# Altium project sensores_0v1.PrjPCB
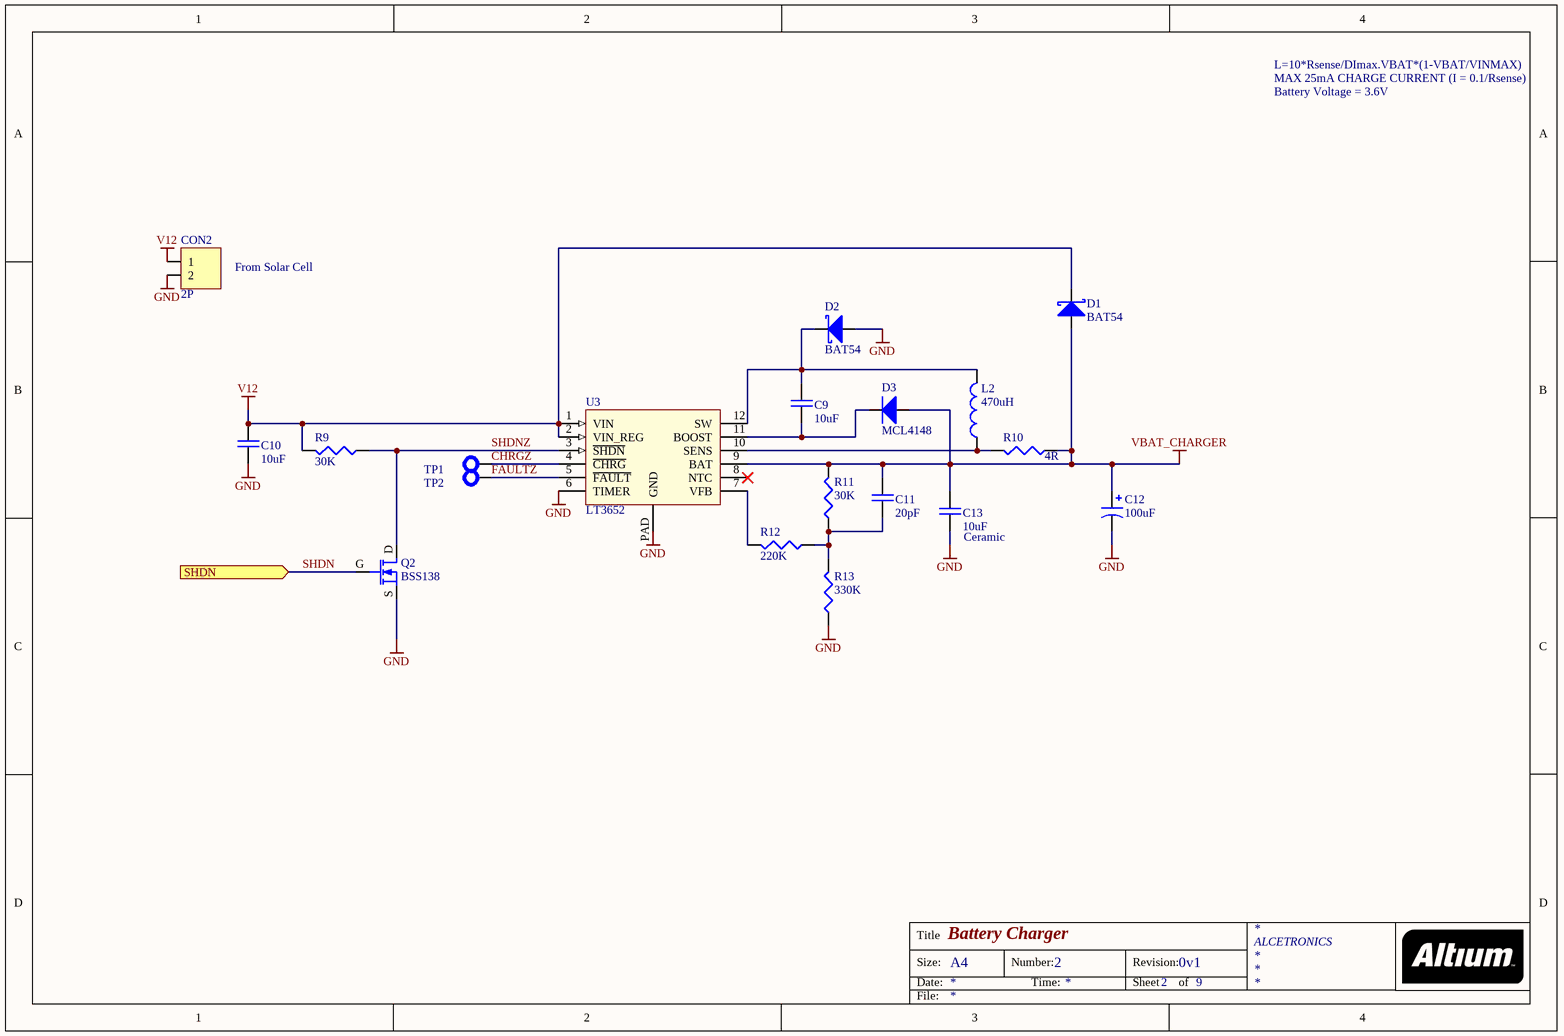
[diagram p0: Charger.SchDoc]
4 sheets, 91 parts. Net scope: flat (ports and power ports of the same name join across sheets).
Board file: sensores_0v1.PcbDoc
Sheets:
  Charger.SchDoc
  Boost.SchDoc
  Humidity.SchDoc
  Connectors.SchDoc

## Sheet Charger.SchDoc: Battery Charger
size A4; DrawnBy: Ricardo Rodrigues; Address1: ALCETRONICS; DocumentNumber: 2; Revision: 0v1; SheetNumber: 2; SheetTotal: 9

### Parts
C9  10uF  [0805]
C10  10uF  [0805]
C11  20pF  [0603]
C12  100uF  [RADIAL-5MM]
C13  10uF  [0805]
CON2  2P  [INTERLOCK2-5MM-FIXED]
D1  BAT54  [SOT-23@AK]
D2  BAT54  [SOT-23@AK]
D3  MCL4148  [0805@DIODE]
L2  470uH  [12X12]
Q2  BSS138  [SOT-23@GSD]
R9  30K  [0603]
R10  4R  [1206]
R11  30K  [0603]
R12  220K  [0603]
R13  330K  [0603]
TP1  Test Point  [TERMINAL]  (value not drawn)  (no BOM)
TP2  Test Point  [TERMINAL]  (value not drawn)  (no BOM)
U3  LT3652  [MSOP12@EP]

### Ports
SHDN (in)

### Nets
GND: C10.1 C12.2(N) C13.1 CON2.2 D2.A Q2.S R13.1 U3.6(TIMER) U3.PAD(GND)
V12: C10.2 CON2.1 D1.K R9.2 U3.1(VIN) U3.2(VIN_REG)
VBAT_CHARGER: C11.2 C12.1(P) C13.2 D1.A D3.A R10.1 R11.2 U3.9(BAT)
CHRGZ: TP1.1(TP) U3.4(~{CHRG})
FAULTZ: TP2.1(TP) U3.5(~{FAULT})
SHDN: Q2.G ; port SHDN
SHDNZ: Q2.D R9.1 U3.3(~{SHDN})
NetC9_1: C9.1 D3.K U3.11(BOOST)
NetC9_2: C9.2 D2.K L2.2 U3.12(SW)
NetC11_1: C11.1 R11.1 R12.1 R13.2
NetL2_1: L2.1 R10.2 U3.10(SENS)
NetR12_2: R12.2 U3.7(VFB)

Not connected (* = marked no-connect by the designer): U3 8(NTC)*

### Notes on the sheet
- MAX 25mA CHARGE CURRENT (I = 0.1/Rsense)
- Battery Voltage = 3.6V
- L=10*Rsense/DImax.VBAT*(1-VBAT/VINMAX)
- From Solar Cell
- (near C13) Ceramic
- Title
- Size:
- Date:
- A4
- Number:
- Time:
- Revision:
- Sheet
- of
- File:

### Library data of the parts
C9-C11 C13 = CAP: Capacitor; Owner: Nuno Brum; Sub-Type: Ceramic; Assembly: INS; Maximum Voltage: *; Creation Date: 2005-04-28; Status: Valid; Validation date: 2006-05-15; Type: Capacitor
C12 = CAP POL: Polarized Capacitor; Owner: Nuno Brum; Sub-Type: Tantalum; Assembly: INS; Validation date: 2006-05-15; Creation Date: 2005-04-28; Status: Valid; Type: Capacitor
CON2 = CON02: Connector 2 pins; Owner: Rui Rebelo; Assembly: INS; Sub-Type: Connector; Creation Date: 2005-05-27; Status: Valid; Validation Date: 2006-05-15; Type: Electrical & Mechanical
D1 D2 = Diode Schottky: Small Signal Schottky Diode; Owner: Nuno Brum; Assembly: INS; Validation date: 2006-05-15; Creation Date: 2001-06-05; Sub-Type: Schottky; Status: Valid; Model: BAT54; Type: Diode
D3 = Diode: Vishay Standard Avalanche Sinterglass Diode; Owner: Nuno Brum; Sub-Type: Generic; Assembly: INS; Validation date: 2006-05-15; Creation Date: 2001-06-05; Status: Valid; Model: MCL4148; Type: Diode
L2 = IND: Inductor; Owner: Nuno Brum; Sub-Type: Generic; Assembly: INS; Validation date: 2006-05-15; Creation Date: 2002-07-17; Status: Valid; Type: Inductor
Q2 = MOSFET-N: N-Channel Logic Level Enhancement Mode Field Effect Transistor; pin to pad: 2>3 3>2; Owner: Nuno Brum; Sub-Type: MOSFET; Assembly: INS; Creation Date: 2001-06-05; Status: Valid; Model: BSS138; Type: Transistor
R9-R13 = RES: Resistor; Owner: Nuno Brum; Sub-Type: Generic; Assembly: INS; Validation date: 2006-05-15; Creation Date: 2002-07-17; Status: Valid; Power: *; Type: Resistor
TP1 TP2 = TEST-PROBE: Test/Probe Point; Owner: Nuno Brum; Sub-Type: Mechanical; Assembly: PCB; Validation Date: 2006-05-15; Type: PCB; Creation Date: 2005-06-01; Status: Valid
U3 = LT3652: Power Tracking 2A Battery Charger for Solar Power; Type: IC; Creation Date: 2012-03-05

## Sheet Boost.SchDoc: Battery Charger Boost Converter
size A4; DocumentNumber: 3; Revision: 0v1; SheetNumber: 3; SheetTotal: 9
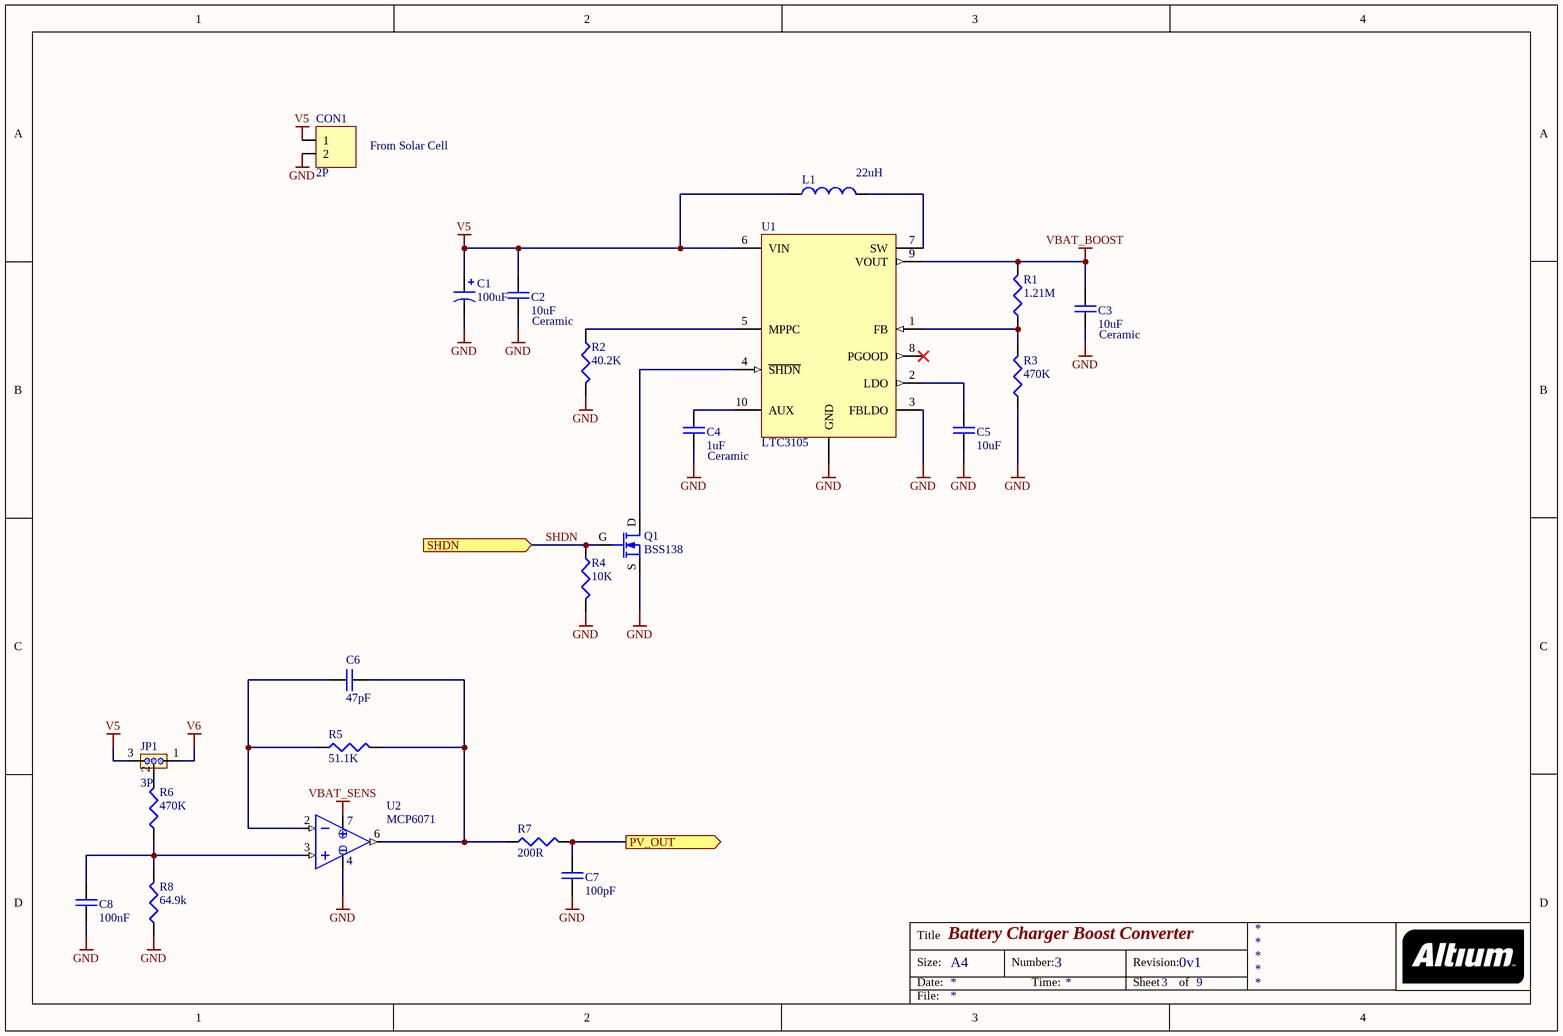
[diagram p1: Boost.SchDoc]

### Parts
C1  100uF  [RADIAL-5MM]
C2  10uF  [0805]
C3  10uF  [0805]
C4  1uF  [0603]
C5  10uF  [0805]
C6  47pF  [0603]
C7  100pF  [0603]
C8  100nF  [0603]
CON1  2P  [JST-2MM]
JP1  3P  [SIP-3]
L1  22uH  [7X7]
Q1  BSS138  [SOT-23@GSD]
R1  1.21M  [0603]
R2  40.2K  [0603]
R3  470K  [0603]
R4  10K  [0603]
R5  51.1K  [0603]
R6  470K  [0603]
R7  200R  [0603]
R8  64.9k  [0603]
U1  LTC3105  [DFN-10]
U2  MCP6071  [SOIC-8]

### Ports
PV_OUT (out), SHDN (in)

### Nets
GND: C1.2(N) C2.1 C3.1 C4.1 C5.1 C7.1 C8.1 CON1.2 Q1.S R2.2 R3.1 R4.2 R8.1 U1.3(FBLDO) U1.PAD(GND) U2.4(VSS)
V5: C1.1(P) C2.2 CON1.1 JP1.3 L1.1 U1.6(VIN)
V6: JP1.1
VBAT_BOOST: C3.2 R1.2 U1.9(VOUT)
VBAT_SENS: U2.7(VDD)
SHDN: Q1.G R4.1 ; port SHDN
NetC4_2: C4.2 U1.10(AUX)
NetC5_2: C5.2 U1.2(LDO)
NetC6_1: C6.1 R5.1 U2.2(INN)
NetC6_2: C6.2 R5.2 R7.1 U2.6(VOUT)
NetC7_2: C7.2 R7.2 ; port PV_OUT
NetC8_2: C8.2 R6.1 R8.2 U2.3(INP)
NetJP1_2: JP1.2 R6.2
NetL1_2: L1.2 U1.7(SW)
NetQ1_D: Q1.D U1.4(~{SHDN})
NetR1_1: R1.1 R3.2 U1.1(FB)
NetR2_1: R2.1 U1.5(MPPC)

Not connected (* = marked no-connect by the designer): U1 8(PGOOD)*

### Notes on the sheet
- From Solar Cell
- Ceramic
- (near C3) Ceramic
- Title
- Size:
- Date:
- A4
- Number:
- Time:
- Revision:
- Sheet
- of
- File:

### Library data of the parts
C1 = CAP POL: as C12 on sheet Charger; Validation date: 2006-05-15; Creation Date: 2005-04-28; Status: Valid; Type: Capacitor
C2-C8 = CAP: as C9 on sheet Charger; Maximum Voltage: *; Creation Date: 2005-04-28; Status: Valid; Validation date: 2006-05-15; Type: Capacitor
CON1 = CON02: as CON2 on sheet Charger; Sub-Type: Connector; Creation Date: 2005-05-27; Status: Valid; Validation Date: 2006-05-15; Type: Electrical & Mechanical
JP1 = JMP3: 3-Jumper; Owner: Nuno Brum; Sub-Type: Connector; STATE1: 0; Assembly: INS; Validation Date: 2006-05-15; Creation Date: 2002-07-17; Status: Valid; Type: Electrical & Mechanical
L1 = IND: as L2 on sheet Charger; Validation date: 2006-05-15; Creation Date: 2002-07-17; Status: Valid; Type: Inductor
Q1 = MOSFET-N: N-Channel Logic Level Enhancement Mode Field Effect Transistor; pin to pad: 2>3 3>2; Owner: Nuno Brum; Sub-Type: MOSFET; Assembly: INS; Creation Date: 2001-06-05; Status: Valid; Model: BSS138; Type: Transistor
R1-R8 = RES: as R9 on sheet Charger; Validation date: 2006-05-15; Creation Date: 2002-07-17; Status: Valid; Power: *; Type: Resistor
U1 = LTC3105: 400mA Step-Up DCDC Converter With MPPC and 250mV Start-Up; Type: IC; Creation Date: 2012-03-14
U2 = MCP6V26: Low-Offset Opamp; Type: IC; Creation Date: 2012-03-15

## Sheet Humidity.SchDoc: Humidity Sensor
size A4; DocumentNumber: 6; Revision: 0v1; SheetNumber: 6; SheetTotal: 9
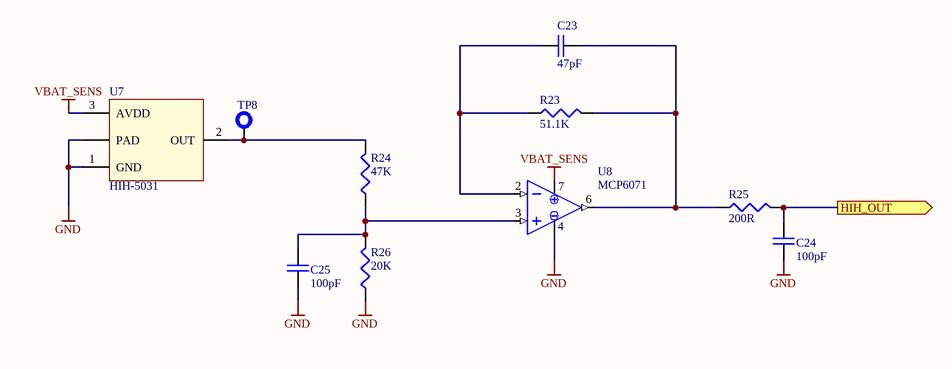
[diagram p2: Humidity.SchDoc]

### Parts
C23  47pF  [0603]
C24  100pF  [0603]
C25  100pF  [0603]
R23  51.1K  [0603]
R24  47K  [0603]
R25  200R  [0603]
R26  20K  [0603]
TP8  Test Point  [TERMINAL]  (value not drawn)  (no BOM)
U7  HIH-5031  [HIH]
U8  MCP6071  [SOIC-8]

### Ports
HIH_OUT (out)

### Nets
GND: C24.1 C25.1 R26.1 U7.1(GND) U7.PAD U8.4(VSS)
VBAT_SENS: U7.3(AVDD) U8.7(VDD)
NetC23_1: C23.1 R23.1 U8.2(INN)
NetC23_2: C23.2 R23.2 R25.1 U8.6(VOUT)
NetC24_2: C24.2 R25.2 ; port HIH_OUT
NetC25_2: C25.2 R24.1 R26.2 U8.3(INP)
NetR24_2: R24.2 TP8.1(TP) U7.2(OUT)

### Notes on the sheet
- Title
- Size:
- Date:
- A4
- Number:
- Time:
- Revision:
- Sheet
- of
- File:

### Library data of the parts
C23-C25 = CAP: as C9 on sheet Charger; Maximum Voltage: *; Creation Date: 2005-04-28; Status: Valid; Validation date: 2006-05-15; Type: Capacitor
R23-R26 = RES: as R9 on sheet Charger; Validation date: 2006-05-15; Creation Date: 2002-07-17; Status: Valid; Power: *; Type: Resistor
TP8 = TEST-PROBE: as TP1 on sheet Charger; Validation Date: 2006-05-15; Type: PCB; Creation Date: 2005-06-01; Status: Valid
U7 = HIH-5031: Low Voltage Humidity Sensor; Type: IC; Creation Date: 2012-03-05
U8 = MCP6V26: Low-Offset Opamp; Type: IC; Creation Date: 2012-03-15

## Sheet Connectors.SchDoc: Connectors
size A4; DocumentNumber: 10; Revision: 0v1; SheetNumber: 10; SheetTotal: 10
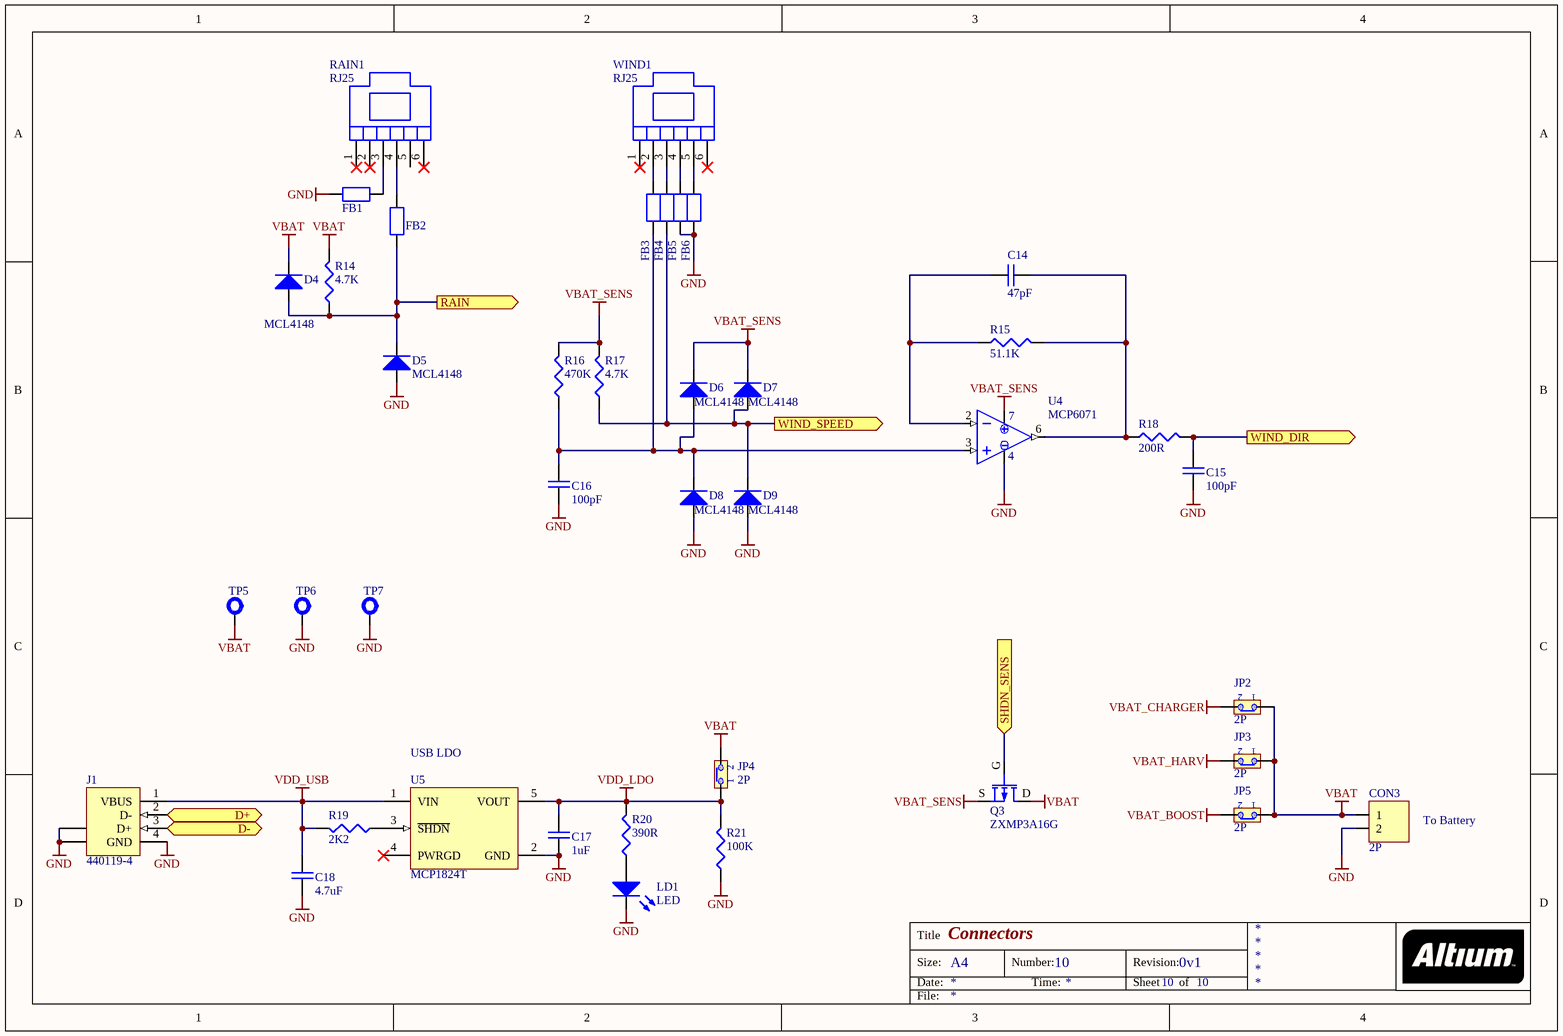
[diagram p3: Connectors.SchDoc]

### Parts
C14  47pF  [0603]
C15  100pF  [0603]
C16  100pF  [0603]
C17  1uF  [0805]
C18  4.7uF  [0805]
CON3  2P  [INTERLOCK2-5MM-FIXED]
D4  MCL4148  [0805@DIODE]
D5  MCL4148  [0805@DIODE]
D6  MCL4148  [0805@DIODE]
D7  MCL4148  [0805@DIODE]
D8  MCL4148  [0805@DIODE]
D9  MCL4148  [0805@DIODE]
FB1  150Z_100MHz  [1806]  (value not drawn)
FB2  150Z_100MHz  [1806]  (value not drawn)
FB3  150Z_100MHz  [1806]  (value not drawn)
FB4  150Z_100MHz  [1806]  (value not drawn)
FB5  150Z_100MHz  [1806]  (value not drawn)
FB6  150Z_100MHz  [1806]  (value not drawn)
J1  440119-4  [440119]
JP2  2P  [SIP-2]
JP3  2P  [SIP-2]
JP4  2P  [SIP-2]
JP5  2P  [SIP-2]
LD1  LED  [0805@DIODE]
Q3  ZXMP3A16G  [SOT-223@GDSD]
R14  4.7K  [0603]
R15  51.1K  [0603]
R16  470K  [0603]
R17  4.7K  [0603]
R18  200R  [0603]
R19  2K2  [0603]
R20  390R  [0603]
R21  100K  [0603]
RAIN1  RJ25  [RJ25]
TP5  Test Point  [TERMINAL]  (value not drawn)  (no BOM)
TP6  Test Point  [TEST-PROBE2]  (value not drawn)  (no BOM)
TP7  Test Point  [TERMINAL]  (value not drawn)  (no BOM)
U4  MCP6071  [SOIC-8]
U5  MCP1824T  [SOT-23-5]
WIND1  RJ25  [RJ25]

### Ports
D+ (bidir), D- (bidir), RAIN (out), SHDN_SENS (in), WIND_DIR (out), WIND_SPEED (out)

### Nets
GND: C15.1 C16.1 C17.1 C18.1 CON3.2 D5.A D8.A D9.A FB1.1 FB5.2 FB6.2 J1.4(GND) J1.5(SHLD) J1.6(SHLD) LD1.K R21.1 TP6.1(TP) TP7.1(TP) U4.4(VSS) U5.2(GND)
VBAT: CON3.1 D4.K JP2.1 JP3.1 JP4.2 JP5.1 Q3.D R14.2 TP5.1(TP)
VBAT_BOOST: JP5.2
VBAT_CHARGER: JP2.2
VBAT_HARV: JP3.2
VBAT_SENS: D6.K D7.K Q3.S R16.2 R17.2 U4.7(VDD)
VDD_LDO: C17.2 JP4.1 R20.2 R21.2 U5.5(VOUT)
VDD_USB: C18.2 J1.1(VBUS) R19.2 U5.1(VIN)
NetC14_1: C14.1 R15.1 U4.2(INN)
NetC14_2: C14.2 R15.2 R18.1 U4.6(VOUT)
NetC15_2: C15.2 R18.2 ; port WIND_DIR
NetC16_2: C16.2 D6.A D8.K FB3.2 R16.1 U4.3(INP)
NetD4_A: D4.A D5.K FB2.1 R14.1 ; port RAIN
NetD7_A: D7.A D9.K FB4.2 R17.1 ; port WIND_SPEED
NetFB1_2: FB1.2 RAIN1.3
NetFB2_2: FB2.2 RAIN1.4
NetFB3_1: FB3.1 WIND1.2
NetFB4_1: FB4.1 WIND1.3
NetFB5_1: FB5.1 WIND1.4
NetFB6_1: FB6.1 WIND1.5
NetJ1_2: J1.2(D-) ; port D+
NetJ1_3: J1.3(D+) ; port D-
NetLD1_A: LD1.A R20.1
NetQ3_G: Q3.G ; port SHDN_SENS
NetR19_1: R19.1 U5.3(~{SHDN})

Not connected (* = marked no-connect by the designer): RAIN1 1* 2* 5 6*; U5 4(PWRGD)*; WIND1 1* 6*

### Notes on the sheet
- (near U5) USB LDO
- To Battery
- Title
- Size:
- Date:
- A4
- Number:
- Time:
- Revision:
- Sheet
- of
- File:

### Library data of the parts
C14-C18 = CAP: as C9 on sheet Charger; Maximum Voltage: *; Creation Date: 2005-04-28; Status: Valid; Validation date: 2006-05-15; Type: Capacitor
CON3 = CON02: as CON2 on sheet Charger; Sub-Type: Connector; Creation Date: 2005-05-27; Status: Valid; Validation Date: 2006-05-15; Type: Electrical & Mechanical
D4-D9 = Diode: as D3 on sheet Charger; Validation date: 2006-05-15; Creation Date: 2001-06-05; Status: Valid; Model: MCL4148; Type: Diode
FB1-FB6 = FERRITE-BEAD-AXIAL: Ferrite bead; Sub-Type: Filter; Owner: Sergio Pires; Type: Electrical & Mechanical; Assembly: INS; Creation Date: 2005-10-20; Status: New
J1 = 440119-4: USB 1.1, Right Angle, Thru-Hole, B Type, Receptacle, 4 Position, Black; ContactMaterial: Copper Alloy; ContactPlating: Gold (5) over Nickel; TerminationLength: 2.84mm [0.112in.]; PCB_Layout: Complies with manufacturer's recommendation.; DrillSize: Corresponds to nominal value.; PanelGround: Without; Published: 15-Jul-2004; DatasheetDocument: 12-Jan-2004; PackageDocument: 12-Jan-2004; PackageReference: 440119; Publisher: Altium Limited; HousingMaterial: Thermoplastic; ComponentLink1Description: Manufacturer Link; ComponentLink1URL: http://www.tycoelectronics.com/; ComponentLink2Description: Packaging Specification; ComponentLink2URL: http://ecommas.tycoelectronics.com/commerce/DocumentDelivery/DDEController?Action=showdoc&DocId=Customer+Drawing%7F440119%7FC%7Ftif%7FEnglish%7FC_440119_C.tif
JP2-JP5 = JMP2: 2-pin Jumper; Owner: Nuno Brum; Sub-Type: Connector; STATE1: 1; Assembly: INS; Validation Date: 2006-05-15; Creation Date: 2002-07-17; Status: Valid; Type: Electrical & Mechanical
LD1 = LED: Light emitting diode; Owner: Nuno Brum; Assembly: INS; Creation Date: 2001-06-05; Sub-Type: LED; Status: Valid; Validation date: 2006-05-15; Model: LED; Type: Diode
Q3 = MOSFET-P: P-Channel Logic Level Enhancement Mode Field Effect Transistor; Owner: Nuno Brum; Sub-Type: MOSFET; Assembly: INS; Validation date: 2006-05-15; Creation Date: 2001-06-05; Status: Valid; Model: ZXMP3A16G; Type: Transistor
R14-R21 = RES: as R9 on sheet Charger; Validation date: 2006-05-15; Creation Date: 2002-07-17; Status: Valid; Power: *; Type: Resistor
RAIN1 WIND1 = RJ25: RJ25 Connector; Type: Connector; Creation Date: 2012-03-26
TP5-TP7 = TEST-PROBE: as TP1 on sheet Charger; Validation Date: 2006-05-15; Type: PCB; Creation Date: 2005-06-01; Status: Valid
U4 = MCP6V26: Low-Offset Opamp; Type: IC; Creation Date: 2012-03-15
U5 = MCP1824T: 300 mA, Low Voltage, Low Quiescent Current LDO Regulator, 5-Pin SOT-23, Extended Temperature, Tape and Reel; Published: 29-Jan-2009; DatasheetVersion: revA, Aug-2007; PackageVersion: revBB, Aug-2009; PackageReference: SOT-23-OT5; Publisher: Altium Limited; PackageDescription: 5-Lead Plastic Small Outline Transistor (OT) [SOT-23]; Supplier 1: Digi-Key; Supplier Part Number 1: MCP1824T-3302E/OTTR-ND; Supplier 2: Digi-Key; Supplier Part Number 2: MCP1824T-3302E/OTCT-ND; Supplier 3: Digi-Key; Supplier Part Number 3: MCP1824T-3302E/OTDKR-ND; Supplier 4: Farnell; Supplier Part Number 4: 1578387; Code_IPC: SOT23-5; ComponentLink1Description: Datasheet; ComponentLink1URL: http://ww1.microchip.com/downloads/en/DeviceDoc/22070a.pdf; ComponentLink2Description: Packaging Specification; ComponentLink2URL: http://www.microchip.com/stellent/groups/techpub_sg/documents/packagingspec/en012702.pdf; ComponentLink3Description: Microchip.com Home; ComponentLink3URL: http://www.microchip.com/

## Nets that join several sheets
GND: Charger (9 pins), Boost (16 pins), Humidity (6 pins), Connectors (20 pins)
VBAT_BOOST: Boost (C3.2 R1.2 U1.9), Connectors (JP5.2)
VBAT_CHARGER: Charger (8 pins), Connectors (JP2.2)
VBAT_SENS: Boost (U2.7), Humidity (U7.3 U8.7), Connectors (6 pins)
SHDN: Charger (Q2.G), Boost (Q1.G R4.1)